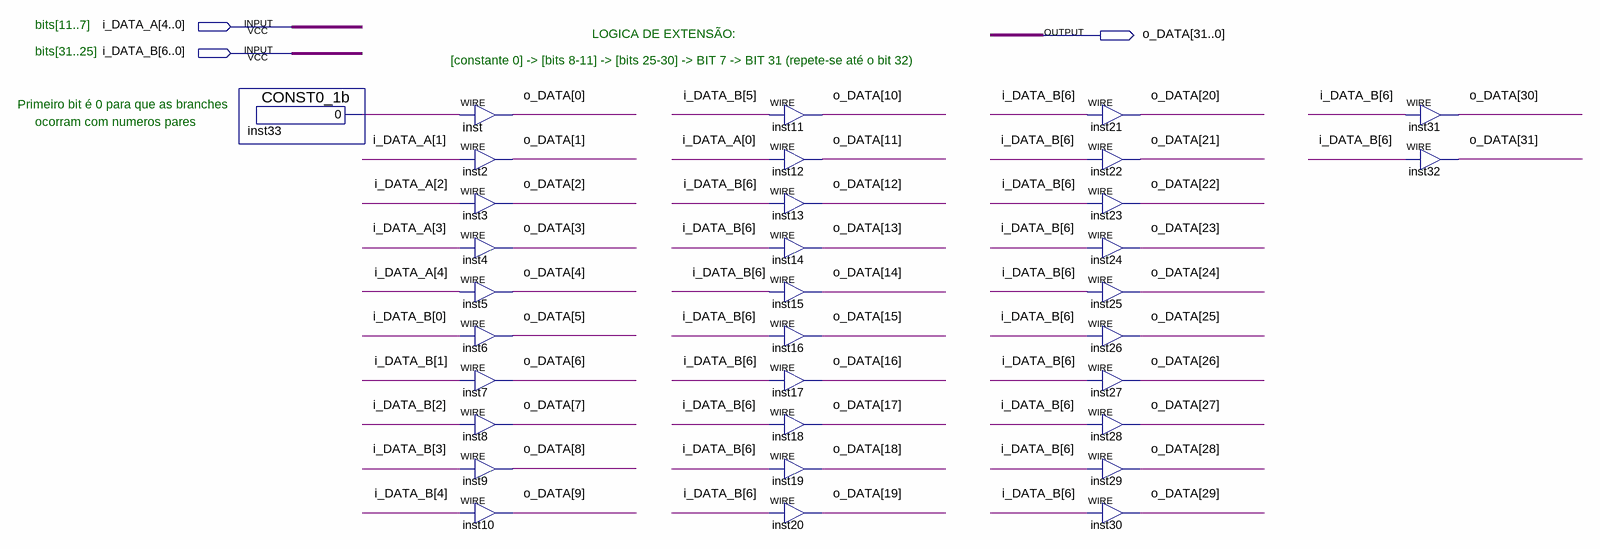
[diagram p0: schematic sheet]
// Quartus schematic signal_ext12tipoB_32.bdf as structural Verilog: 33 symbols, 3 pins
module signal_ext12tipoB_32 (
  input  [4:0] i_DATA_A,
  input  [6:0] i_DATA_B,
  output [31:0] o_DATA
);

  wire inst33_result;

  CONST0_1b inst33 (.result(inst33_result));
  assign o_DATA[0] = inst33_result;  // WIRE inst
  assign o_DATA[1] = i_DATA_A[1];  // WIRE inst2
  assign o_DATA[2] = i_DATA_A[2];  // WIRE inst3
  assign o_DATA[3] = i_DATA_A[3];  // WIRE inst4
  assign o_DATA[4] = i_DATA_A[4];  // WIRE inst5
  assign o_DATA[5] = i_DATA_B[0];  // WIRE inst6
  assign o_DATA[6] = i_DATA_B[1];  // WIRE inst7
  assign o_DATA[7] = i_DATA_B[2];  // WIRE inst8
  assign o_DATA[8] = i_DATA_B[3];  // WIRE inst9
  assign o_DATA[9] = i_DATA_B[4];  // WIRE inst10
  assign o_DATA[10] = i_DATA_B[5];  // WIRE inst11
  assign o_DATA[11] = i_DATA_A[0];  // WIRE inst12
  assign o_DATA[12] = i_DATA_B[6];  // WIRE inst13
  assign o_DATA[13] = i_DATA_B[6];  // WIRE inst14
  assign o_DATA[14] = i_DATA_B[6];  // WIRE inst15
  assign o_DATA[15] = i_DATA_B[6];  // WIRE inst16
  assign o_DATA[16] = i_DATA_B[6];  // WIRE inst17
  assign o_DATA[17] = i_DATA_B[6];  // WIRE inst18
  assign o_DATA[18] = i_DATA_B[6];  // WIRE inst19
  assign o_DATA[19] = i_DATA_B[6];  // WIRE inst20
  assign o_DATA[20] = i_DATA_B[6];  // WIRE inst21
  assign o_DATA[21] = i_DATA_B[6];  // WIRE inst22
  assign o_DATA[22] = i_DATA_B[6];  // WIRE inst23
  assign o_DATA[23] = i_DATA_B[6];  // WIRE inst24
  assign o_DATA[24] = i_DATA_B[6];  // WIRE inst25
  assign o_DATA[25] = i_DATA_B[6];  // WIRE inst26
  assign o_DATA[26] = i_DATA_B[6];  // WIRE inst27
  assign o_DATA[27] = i_DATA_B[6];  // WIRE inst28
  assign o_DATA[28] = i_DATA_B[6];  // WIRE inst29
  assign o_DATA[29] = i_DATA_B[6];  // WIRE inst30
  assign o_DATA[30] = i_DATA_B[6];  // WIRE inst31
  assign o_DATA[31] = i_DATA_B[6];  // WIRE inst32

  // Notes on the sheet:
  //   bits[11..7]
  //   LOGICA DE EXTENSÃO:
  //   bits[31..25]
  //   [constante 0] -> [bits 8-11] -> [bits 25-30] -> BIT 7 -> BIT 31 (repete-se até o bit 32)
  //   Primeiro bit é 0 para que as branches
  //   ocorram com numeros pares
endmodule
